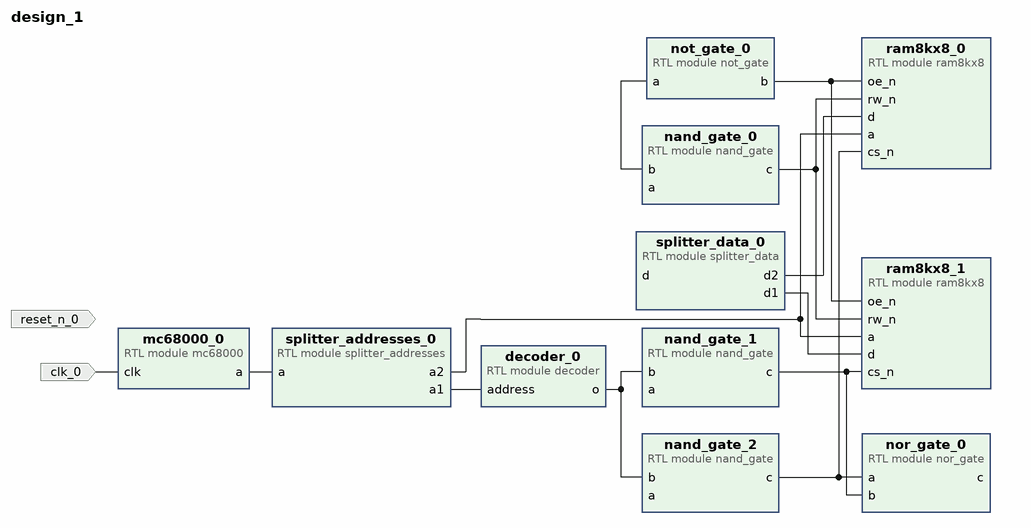
[diagram p0: block diagram of the top level]
# Vivado block design design_1, xc7a100tcsg324-1, Vivado 2018.3
create_bd_design design_1

create_bd_port -dir I -type clk clk_0
create_bd_port -dir I -type rst reset_n_0

create_bd_cell -type module -reference ram8kx8 ram8kx8_0
create_bd_cell -type module -reference ram8kx8 ram8kx8_1
create_bd_cell -type module -reference not_gate not_gate_0
create_bd_cell -type module -reference nor_gate nor_gate_0
create_bd_cell -type module -reference decoder decoder_0
create_bd_cell -type module -reference splitter_addresses splitter_addresses_0
create_bd_cell -type module -reference nand_gate nand_gate_0
create_bd_cell -type module -reference nand_gate nand_gate_1
create_bd_cell -type module -reference nand_gate nand_gate_2
create_bd_cell -type module -reference splitter_data splitter_data_0
create_bd_cell -type module -reference mc68000 mc68000_0

# ---- connections ----

connect_bd_net -net clk_0_1 [get_bd_ports clk_0] [get_bd_pins mc68000_0/clk]
# net reset_n_0_1 has one end: reset_n_0
# net mc68000_0_as_n has one end: nand_gate_0/a
connect_bd_net -net mc68000_0_rw_n [get_bd_pins nand_gate_0/b] [get_bd_pins not_gate_0/a]
connect_bd_net [get_bd_pins nand_gate_0/c] [get_bd_pins ram8kx8_1/rw_n] [get_bd_pins ram8kx8_0/rw_n]
connect_bd_net [get_bd_pins not_gate_0/b] [get_bd_pins ram8kx8_1/oe_n] [get_bd_pins ram8kx8_0/oe_n]
connect_bd_net [get_bd_pins mc68000_0/a] [get_bd_pins splitter_addresses_0/a]
connect_bd_net [get_bd_pins splitter_addresses_0/a1] [get_bd_pins decoder_0/address]
connect_bd_net [get_bd_pins splitter_addresses_0/a2] [get_bd_pins ram8kx8_0/a] [get_bd_pins ram8kx8_1/a]
# net mc68000_0_d has one end: splitter_data_0/d
connect_bd_net [get_bd_pins splitter_data_0/d1] [get_bd_pins ram8kx8_1/d]
connect_bd_net [get_bd_pins splitter_data_0/d2] [get_bd_pins ram8kx8_0/d]
# net mc68000_0_uds_n has one end: nand_gate_2/a
# net mc68000_0_lds_n has one end: nand_gate_1/a
connect_bd_net [get_bd_pins decoder_0/o] [get_bd_pins nand_gate_1/b] [get_bd_pins nand_gate_2/b]
# net nor_gate_0_c has one end: nor_gate_0/c
connect_bd_net [get_bd_pins nand_gate_2/c] [get_bd_pins ram8kx8_0/cs_n] [get_bd_pins nor_gate_0/a]
connect_bd_net [get_bd_pins nand_gate_1/c] [get_bd_pins ram8kx8_1/cs_n] [get_bd_pins nor_gate_0/b]

validate_bd_design
save_bd_design
